# EAGLE schematic shelves_v60 (EAGLE 9.6.2)

## Sheet 1 of 5
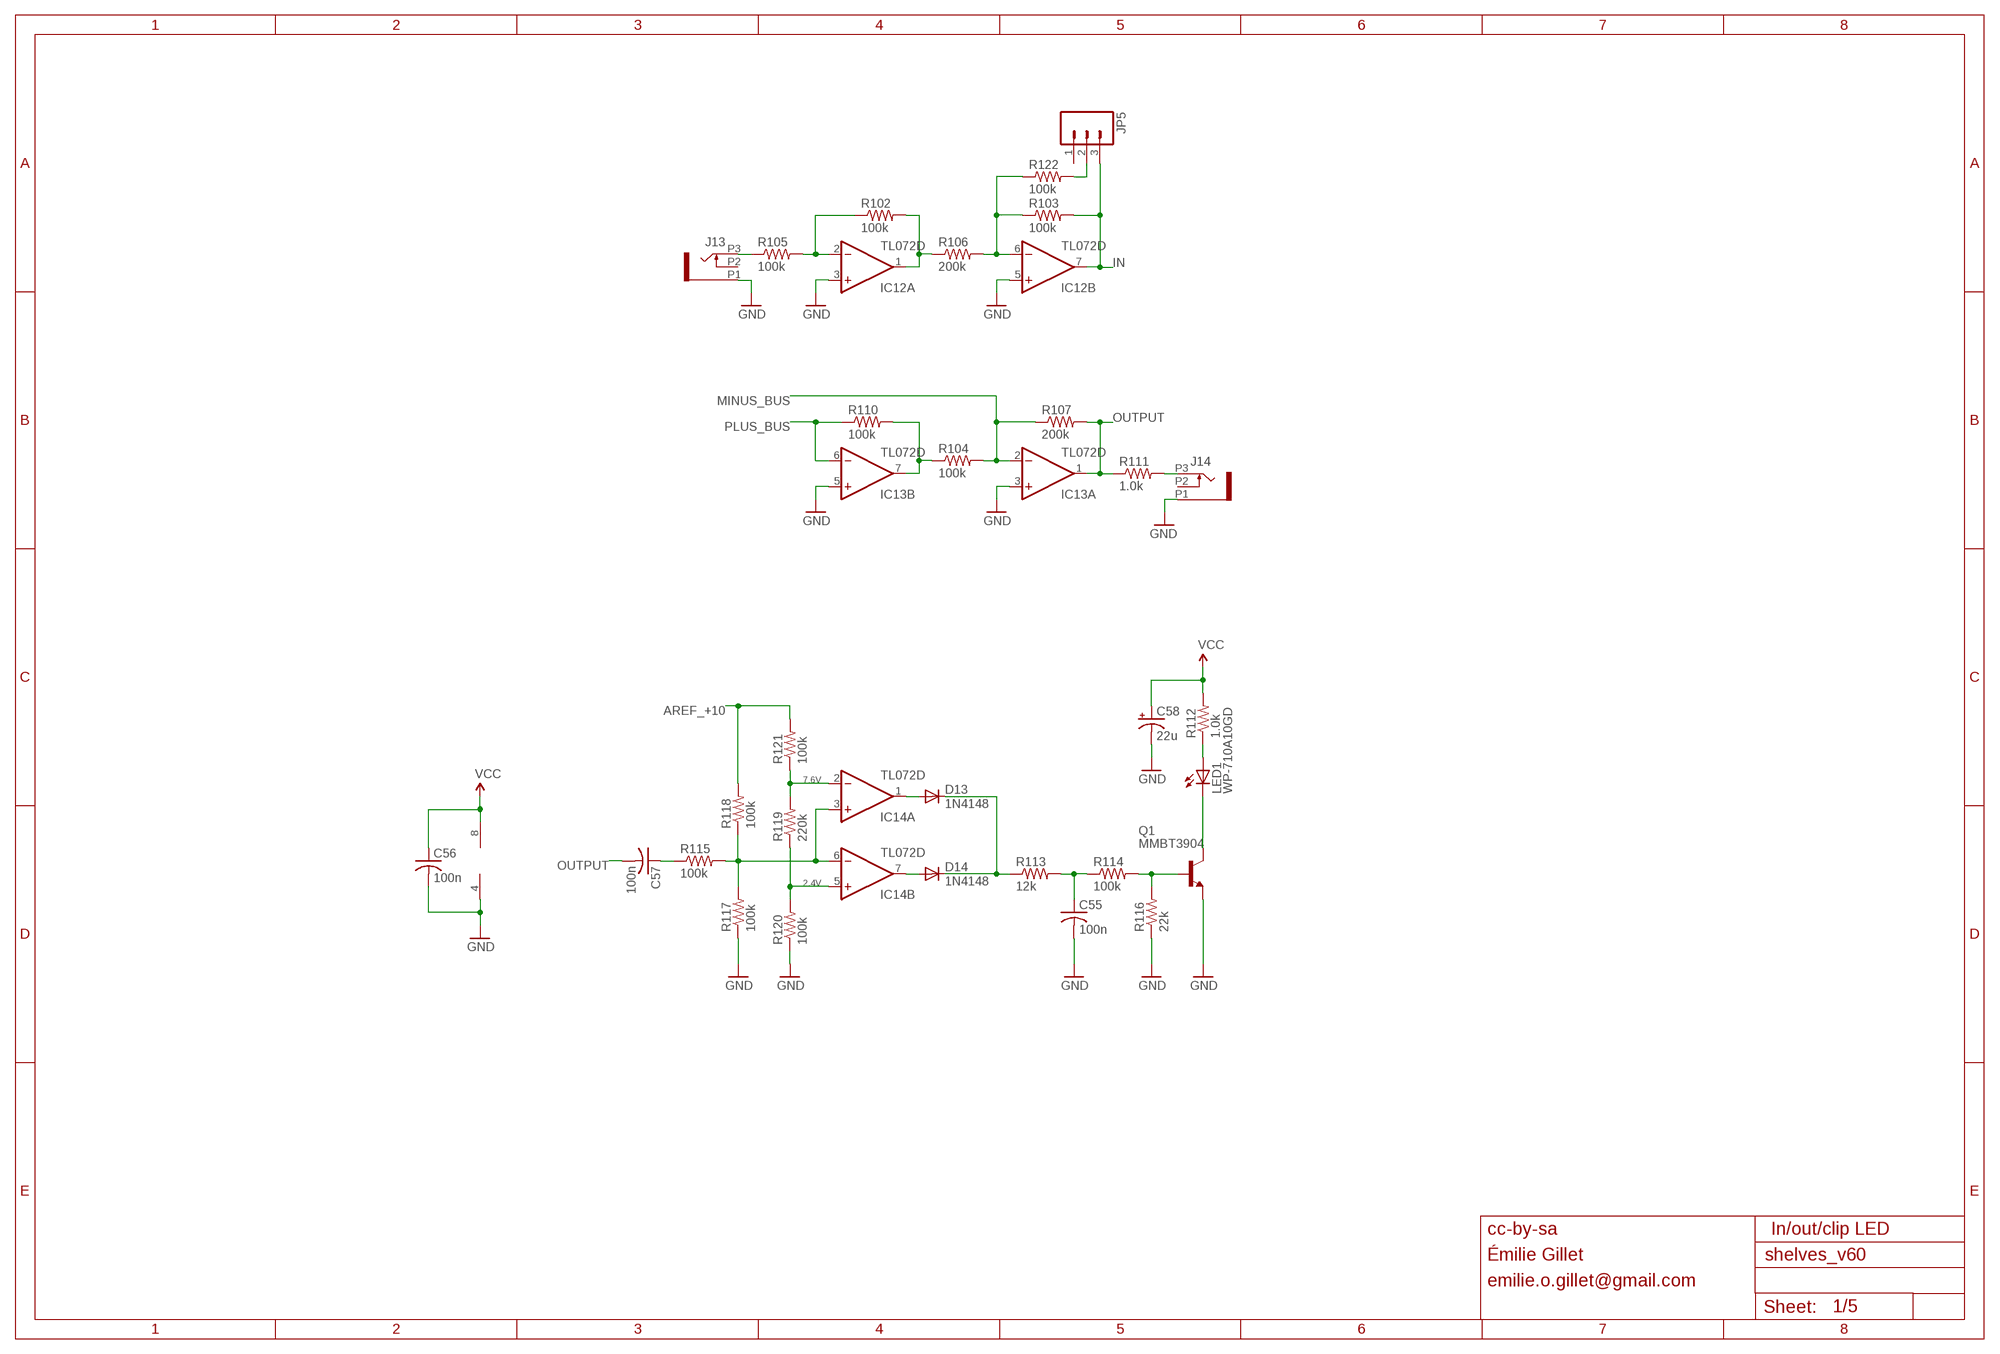
[diagram p0: schematic, sheet 1]

### Parts
C55  100n  C-USC0603  [C0603]
C56  100n  C-USC0603  [C0603]
C57  100n  C-USC0603  [C0603]
C58  22u  CPOL-USC  [PANASONIC_C]
D13  1N4148  DIODE-SOD323-W  [SOD323-W]
D14  1N4148  DIODE-SOD323-W  [SOD323-W]
IC12  TL072D  [SO08]
IC13  TL072D  [SO08]
IC14  TL072D  [SO08]
J13  PJ301_THONKICONN6  [WQP_PJ_301M6]
J14  PJ301_THONKICONN6  [WQP_PJ_301M6]
JP5  M03PTH  [1X03]
LED1  WP-710A10GD  LED3MM  [LED3MM]
Q1  MMBT3904  MMBT3904LT1-NPN-SOT23-BEC  [SOT23-BEC]
R102  100k  R-US_R0603  [R0603]
R103  100k  R-US_R0603  [R0603]
R104  100k  R-US_R0603  [R0603]
R105  100k  R-US_R0603  [R0603]
R106  200k  R-US_R0603  [R0603]
R107  200k  R-US_R0603  [R0603]
R110  100k  R-US_R0603  [R0603]
R111  1.0k  R-US_R0603  [R0603]
R112  1.0k  R-US_R0603  [R0603]
R113  12k  R-US_R0603  [R0603]
R114  100k  R-US_R0603  [R0603]
R115  100k  R-US_R0603  [R0603]
R116  22k  R-US_R0603  [R0603]
R117  100k  R-US_R0603  [R0603]
R118  100k  R-US_R0603  [R0603]
R119  220k  R-US_R0603  [R0603]
R120  100k  R-US_R0603  [R0603]
R121  100k  R-US_R0603  [R0603]
R122  100k  R-US_R0603  [R0603]

### Nets
AREF_+10: R118.2 R121.2 ; also sheet 2,3,4,5
GND: C55.2 C56.2 C58.- IC12.3(A:+IN) IC12.5(B:+IN) IC13.3(A:+IN) IC13.5(B:+IN) IC14.4(P:V-) J13.P1 J14.P1 Q1.E R116.1 R117.1 R120.1 ; also sheet 2,3,4,5
IN: IC12.7(B:OUT) JP5.3 R103.2 ; also sheet 2,3,4
IN_INV: IC12.1(A:OUT) R102.2 R106.1
IN_INV1: IC13.7(B:OUT) R104.1 R110.2
J_IN: J13.P3 R105.1
MINUS_BUS: IC13.2(A:-IN) R104.2 R107.1 ; also sheet 2,3,4
N$6: JP5.2 R122.2
N$9: IC12.2(A:-IN) R102.1 R105.2
N$30: IC12.6(B:-IN) R103.1 R106.2 R122.1
N$60: LED1.K(C) Q1.C
N$93: J14.P3 R111.2
N$94: C57.1 R115.1
N$96: IC14.3(A:+IN) IC14.6(B:-IN) R115.2 R117.2 R118.1
N$97: IC14.2(A:-IN) R119.2 R121.1
N$98: C55.1 R113.2 R114.1
N$99: IC14.5(B:+IN) R119.1 R120.2
N$100: D13.A IC14.1(A:OUT)
N$101: D14.A IC14.7(B:OUT)
N$102: D13.C D14.C R113.1
N$103: LED1.A R112.1
N$104: Q1.B R114.2 R116.2
OUTPUT: C57.2 IC13.1(A:OUT) R107.2 R111.1
PLUS_BUS: IC13.6(B:-IN) R110.1 ; also sheet 2,3,4
VCC: C56.1 C58.+ IC14.8(P:V+) R112.2 ; also sheet 2,3,4,5
Unconnected: J13.P2 J14.P2 JP5.1

### Notes on the sheet
- 7.6V
- 2.4V
- cc-by-sa | In/out/clip LED
- Émilie Gillet
- emilie.o.gillet@gmail.com

## Sheet 2 of 5
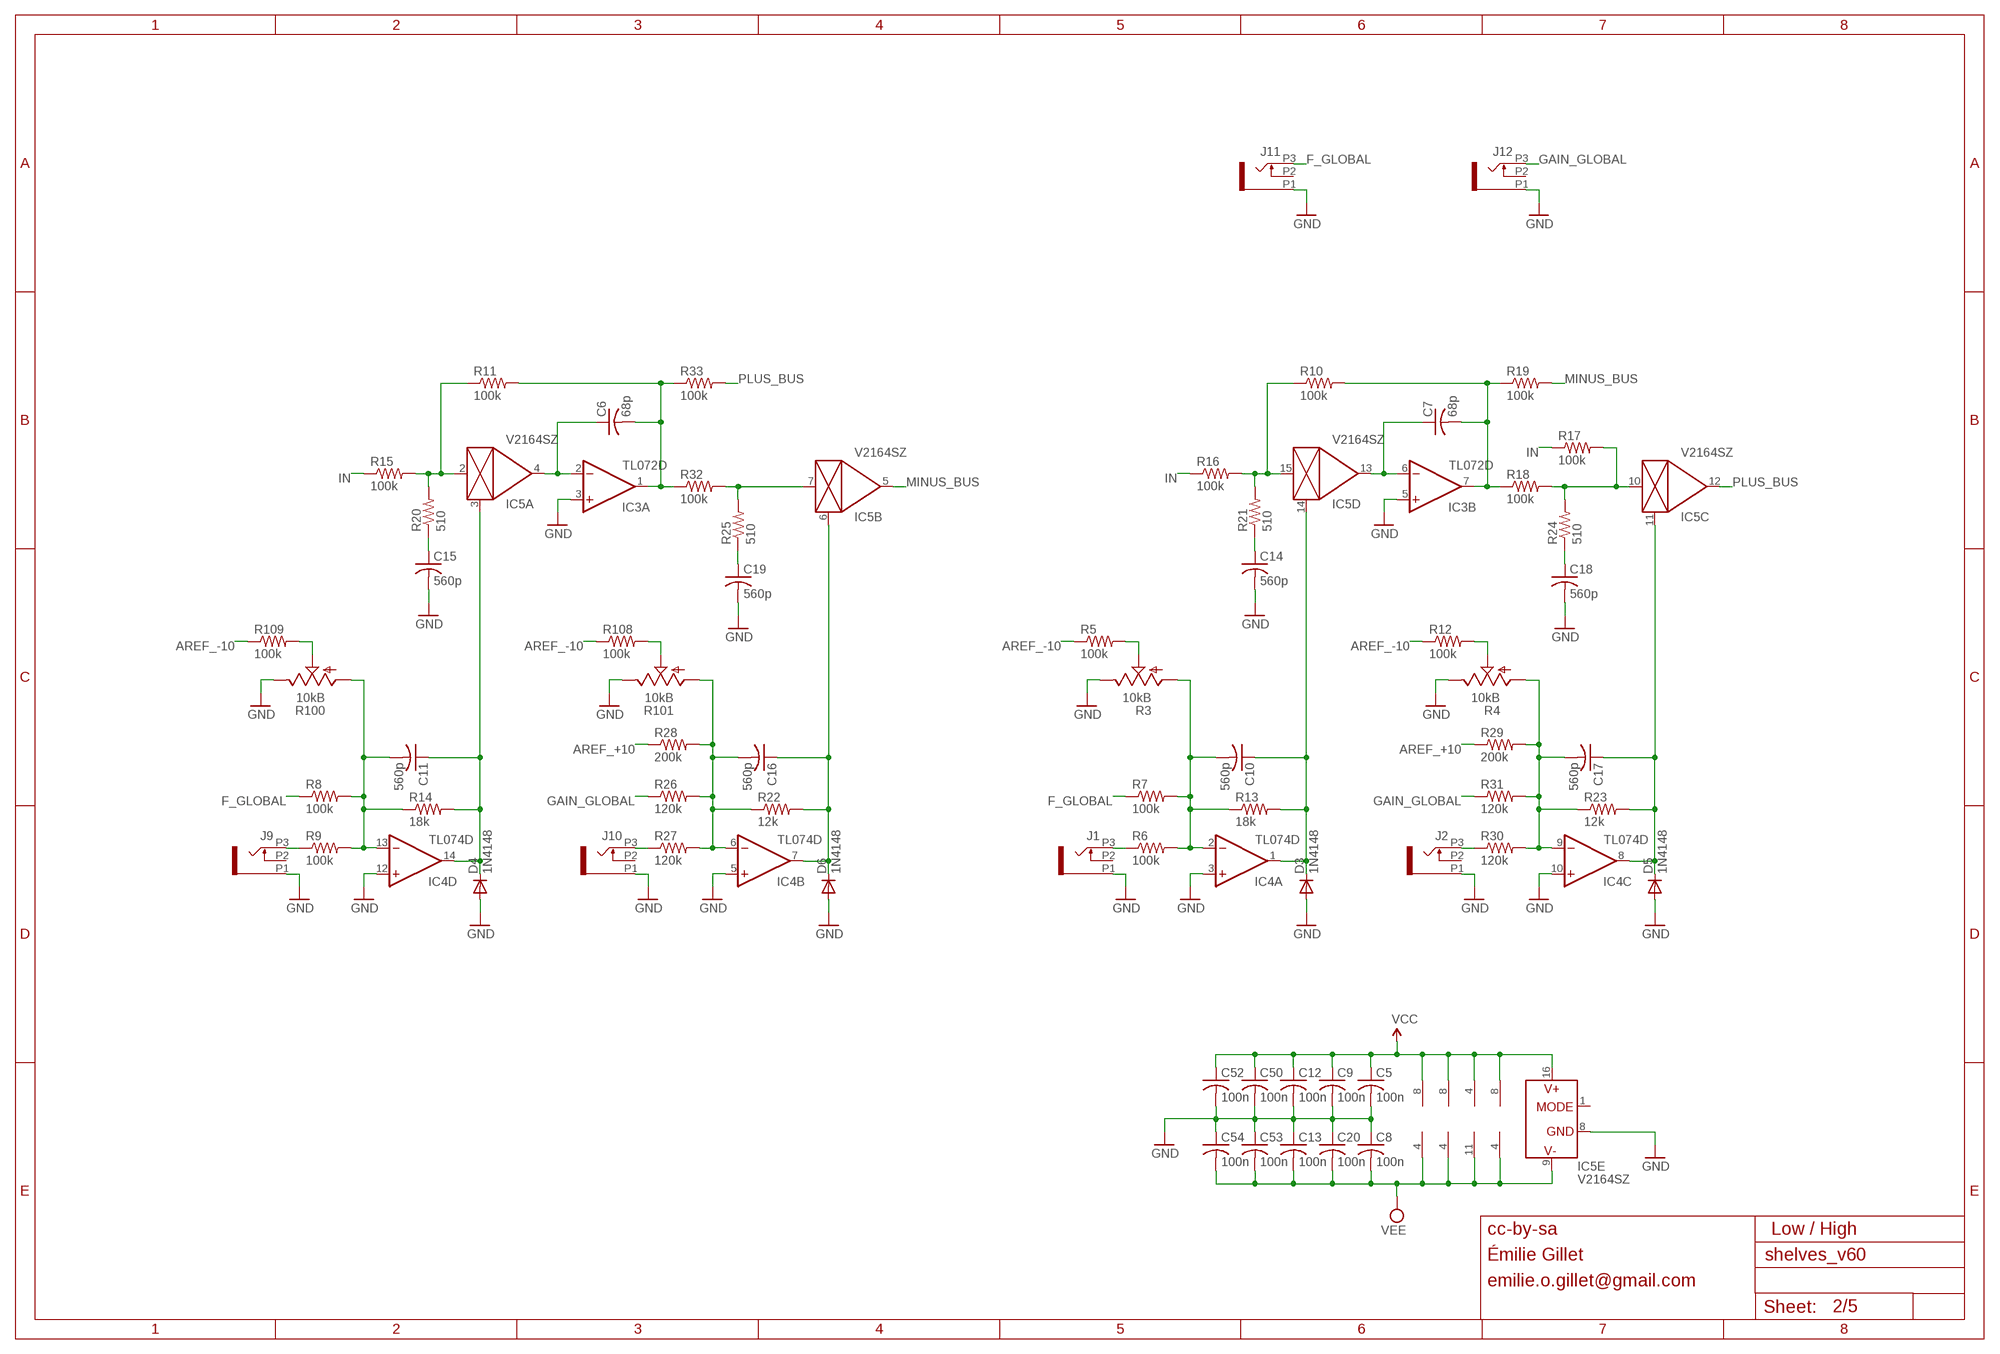
[diagram p1: schematic, sheet 2]

### Parts
C5  100n  C-USC0603  [C0603]
C6  68p  C-USC0603  [C0603]
C7  68p  C-USC0603  [C0603]
C8  100n  C-USC0603  [C0603]
C9  100n  C-USC0603  [C0603]
C10  560p  C-USC0603  [C0603]
C11  560p  C-USC0603  [C0603]
C12  100n  C-USC0603  [C0603]
C13  100n  C-USC0603  [C0603]
C14  560p  C-USC0603  [C0603]
C15  560p  C-USC0603  [C0603]
C16  560p  C-USC0603  [C0603]
C17  560p  C-USC0603  [C0603]
C18  560p  C-USC0603  [C0603]
C19  560p  C-USC0603  [C0603]
C20  100n  C-USC0603  [C0603]
C50  100n  C-USC0603  [C0603]
C52  100n  C-USC0603  [C0603]
C53  100n  C-USC0603  [C0603]
C54  100n  C-USC0603  [C0603]
D3  1N4148  DIODE-SOD323-W  [SOD323-W]
D4  1N4148  DIODE-SOD323-W  [SOD323-W]
D5  1N4148  DIODE-SOD323-W  [SOD323-W]
D6  1N4148  DIODE-SOD323-W  [SOD323-W]
IC3  TL072D  [SO08]
IC4  TL074D  [SO14]
IC5  V2164SZ  SSM2164S  [SOIC16N]
J1  PJ301_THONKICONN6  [WQP_PJ_301M6]
J2  PJ301_THONKICONN6  [WQP_PJ_301M6]
J9  PJ301_THONKICONN6  [WQP_PJ_301M6]
J10  PJ301_THONKICONN6  [WQP_PJ_301M6]
J11  PJ301_THONKICONN6  [WQP_PJ_301M6]
J12  PJ301_THONKICONN6  [WQP_PJ_301M6]
R3  10kB  POT_USVERTICAL_PS  [ALPS_POT_VERTICAL_PS]
R4  10kB  POT_USVERTICAL_PS  [ALPS_POT_VERTICAL_PS]
R5  100k  R-US_R0603  [R0603]
R6  100k  R-US_R0603  [R0603]
R7  100k  R-US_R0603  [R0603]
R8  100k  R-US_R0603  [R0603]
R9  100k  R-US_R0603  [R0603]
R10  100k  R-US_R0603  [R0603]
R11  100k  R-US_R0603  [R0603]
R12  100k  R-US_R0603  [R0603]
R13  18k  R-US_R0603  [R0603]
R14  18k  R-US_R0603  [R0603]
R15  100k  R-US_R0603  [R0603]
R16  100k  R-US_R0603  [R0603]
R17  100k  R-US_R0603  [R0603]
R18  100k  R-US_R0603  [R0603]
R19  100k  R-US_R0603  [R0603]
R20  510  R-US_R0603  [R0603]
R21  510  R-US_R0603  [R0603]
R22  12k  R-US_R0603  [R0603]
R23  12k  R-US_R0603  [R0603]
R24  510  R-US_R0603  [R0603]
R25  510  R-US_R0603  [R0603]
R26  120k  R-US_R0603  [R0603]
R27  120k  R-US_R0603  [R0603]
R28  200k  R-US_R0603  [R0603]
R29  200k  R-US_R0603  [R0603]
R30  120k  R-US_R0603  [R0603]
R31  120k  R-US_R0603  [R0603]
R32  100k  R-US_R0603  [R0603]
R33  100k  R-US_R0603  [R0603]
R100  10kB  POT_USVERTICAL_PS  [ALPS_POT_VERTICAL_PS]
R101  10kB  POT_USVERTICAL_PS  [ALPS_POT_VERTICAL_PS]
R108  100k  R-US_R0603  [R0603]
R109  100k  R-US_R0603  [R0603]

### Nets
AREF_+10: R28.1 R29.1 ; also sheet 1,3,4,5
AREF_-10: R5.1 R12.1 R108.1 R109.1 ; also sheet 3,4,5
F_GLOBAL: J11.P3 R7.1 R8.1 ; also sheet 3,4
GAIN_GLOBAL: J12.P3 R26.1 R31.1 ; also sheet 3,4
GND: C5.2 C8.1 C9.2 C12.2 C13.1 C14.2 C15.2 C18.2 C19.2 C20.1 C50.2 C52.2 C53.1 C54.1 D3.A D4.A D5.A D6.A IC3.3(A:+IN) IC3.5(B:+IN) IC4.3(A:+IN) IC4.5(B:+IN) IC4.10(C:+IN) IC4.12(D:+IN) IC5.8(E:GND) J1.P1 J2.P1 J9.P1 J10.P1 J11.P1 J12.P1 R3.P$1(E) R4.P$1(E) R100.P$1(E) R101.P$1(E) ; also sheet 1,3,4,5
IN: R15.1 R16.1 R17.1 ; also sheet 1,3,4
J_HF_CV: J2.P3 R30.1
J_HF_F: J1.P3 R6.1
J_LF_CV: J10.P3 R27.1
J_LF_F: J9.P3 R9.1
LP: C6.2 IC3.1(A:OUT) R11.2 R32.1 R33.1
LP1: C7.2 IC3.7(B:OUT) R10.2 R18.1 R19.1
MINUS_BUS: IC5.5(B:OUT) R19.2 ; also sheet 1,3,4
N$1: IC5.2(A:IN) R11.1 R15.2 R20.2
N$2: C19.1 R25.1
N$3: C11.1 D4.C IC4.14(D:OUT) IC5.3(A:CTRL) R14.2
N$4: C6.1 IC3.2(A:-IN) IC5.4(A:OUT)
N$5: C14.1 R21.1
N$7: C16.1 D6.C IC4.7(B:OUT) IC5.6(B:CTRL) R22.2
N$10: C15.1 R20.1
N$12: R100.P$2(S) R109.2
N$13: C16.2 IC4.6(B:-IN) R22.1 R26.2 R27.2 R28.2 R101.P$3(A)
N$15: R101.P$2(S) R108.2
N$16: IC5.15(D:IN) R10.1 R16.2 R21.2
N$17: IC5.7(B:IN) R25.2 R32.2
N$18: C11.2 IC4.13(D:-IN) R8.2 R9.2 R14.1 R100.P$3(A)
N$19: C7.1 IC3.6(B:-IN) IC5.13(D:OUT)
N$21: R3.P$2(S) R5.2
N$22: C17.1 D5.C IC4.8(C:OUT) IC5.11(C:CTRL) R23.2
N$23: C17.2 IC4.9(C:-IN) R4.P$3(A) R23.1 R29.2 R30.2 R31.2
N$26: R4.P$2(S) R12.2
N$27: C10.2 IC4.2(A:-IN) R3.P$3(A) R6.2 R7.2 R13.1
N$28: C18.1 R24.1
N$29: IC5.10(C:IN) R17.2 R18.2 R24.2
N$31: C10.1 D3.C IC4.1(A:OUT) IC5.14(D:CTRL) R13.2
PLUS_BUS: IC5.12(C:OUT) R33.2 ; also sheet 1,3,4
VCC: C5.1 C9.1 C12.1 C50.1 C52.1 IC3.8(P:V+) IC4.4(P:V+) IC5.16(E:V+) IC12.8(P:V+) IC13.8(P:V+) ; also sheet 1,3,4,5
VEE: C8.2 C13.2 C20.2 C53.2 C54.2 IC3.4(P:V-) IC4.11(P:V-) IC5.9(E:V-) IC12.4(P:V-) IC13.4(P:V-) ; also sheet 3,4,5
Unconnected: IC5.1(E:MODE) J1.P2 J2.P2 J9.P2 J10.P2 J11.P2 J12.P2

### Notes on the sheet
- cc-by-sa | Low / High
- Émilie Gillet
- emilie.o.gillet@gmail.com

## Sheet 3 of 5
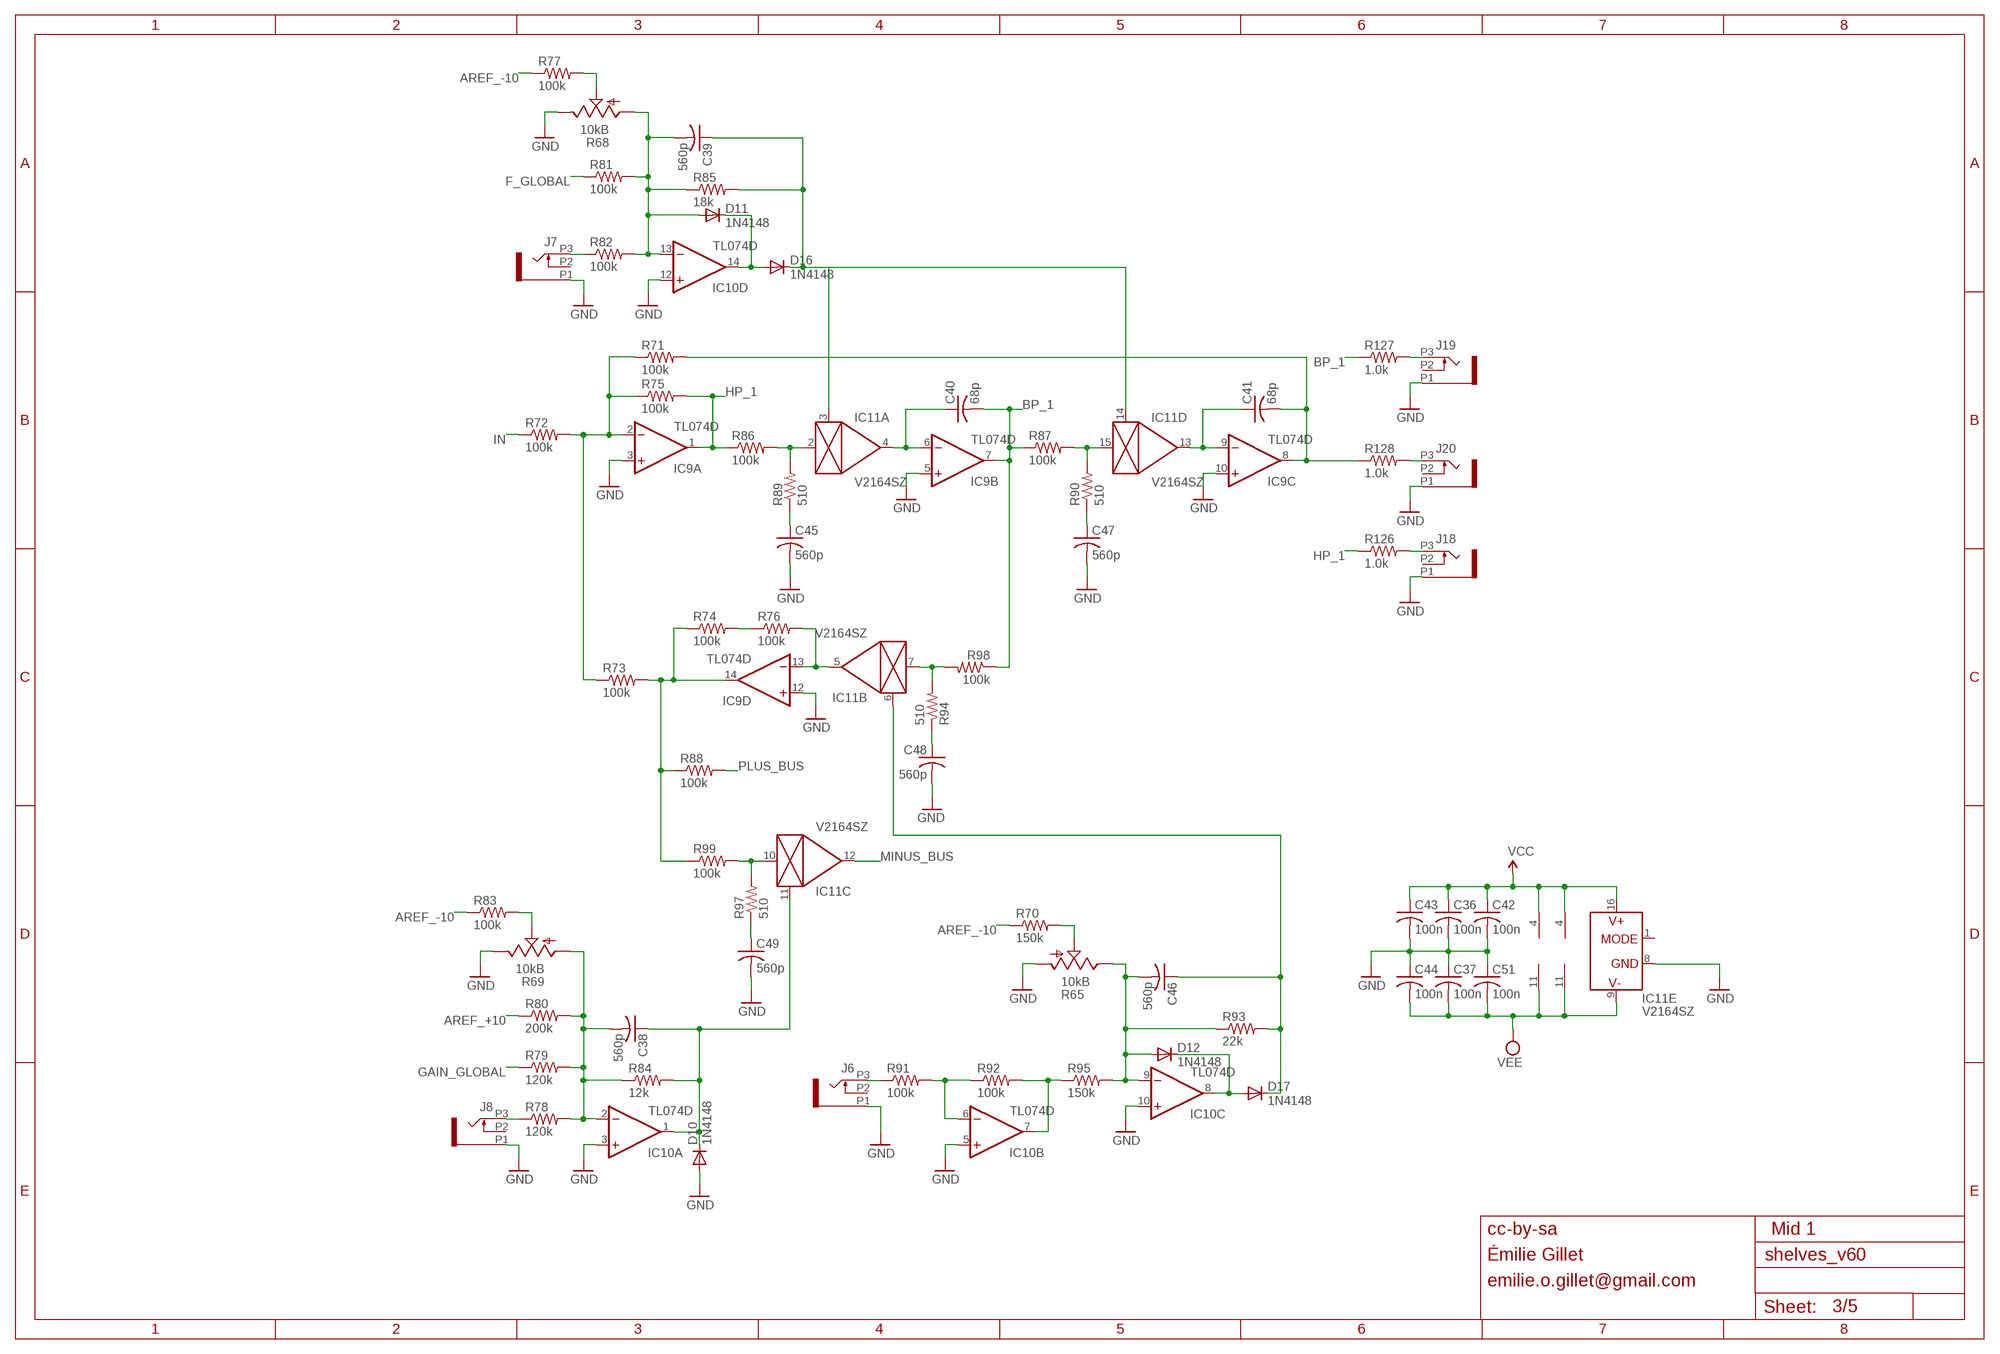
[diagram p2: schematic, sheet 3]

### Parts
C36  100n  C-USC0603  [C0603]
C37  100n  C-USC0603  [C0603]
C38  560p  C-USC0603  [C0603]
C39  560p  C-USC0603  [C0603]
C40  68p  C-USC0603  [C0603]
C41  68p  C-USC0603  [C0603]
C42  100n  C-USC0603  [C0603]
C43  100n  C-USC0603  [C0603]
C44  100n  C-USC0603  [C0603]
C45  560p  C-USC0603  [C0603]
C46  560p  C-USC0603  [C0603]
C47  560p  C-USC0603  [C0603]
C48  560p  C-USC0603  [C0603]
C49  560p  C-USC0603  [C0603]
C51  100n  C-USC0603  [C0603]
D10  1N4148  DIODE-SOD323-W  [SOD323-W]
D11  1N4148  DIODE-SOD323-W  [SOD323-W]
D12  1N4148  DIODE-SOD323-W  [SOD323-W]
D16  1N4148  DIODE-SOD323-W  [SOD323-W]
D17  1N4148  DIODE-SOD323-W  [SOD323-W]
IC9  TL074D  [SO14]
IC10  TL074D  [SO14]
IC11  V2164SZ  SSM2164S  [SOIC16N]
J6  PJ301_THONKICONN6  [WQP_PJ_301M6]
J7  PJ301_THONKICONN6  [WQP_PJ_301M6]
J8  PJ301_THONKICONN6  [WQP_PJ_301M6]
J18  PJ301_THONKICONN6  [WQP_PJ_301M6]
J19  PJ301_THONKICONN6  [WQP_PJ_301M6]
J20  PJ301_THONKICONN6  [WQP_PJ_301M6]
R65  10kB  POT_USVERTICAL  [ALPS_POT_VERTICAL]
R68  10kB  POT_USVERTICAL_PS  [ALPS_POT_VERTICAL_PS]
R69  10kB  POT_USVERTICAL_PS  [ALPS_POT_VERTICAL_PS]
R70  150k  R-US_R0603  [R0603]
R71  100k  R-US_R0603  [R0603]
R72  100k  R-US_R0603  [R0603]
R73  100k  R-US_R0603  [R0603]
R74  100k  R-US_R0603  [R0603]
R75  100k  R-US_R0603  [R0603]
R76  100k  R-US_R0603  [R0603]
R77  100k  R-US_R0603  [R0603]
R78  120k  R-US_R0603  [R0603]
R79  120k  R-US_R0603  [R0603]
R80  200k  R-US_R0603  [R0603]
R81  100k  R-US_R0603  [R0603]
R82  100k  R-US_R0603  [R0603]
R83  100k  R-US_R0603  [R0603]
R84  12k  R-US_R0603  [R0603]
R85  18k  R-US_R0603  [R0603]
R86  100k  R-US_R0603  [R0603]
R87  100k  R-US_R0603  [R0603]
R88  100k  R-US_R0603  [R0603]
R89  510  R-US_R0603  [R0603]
R90  510  R-US_R0603  [R0603]
R91  100k  R-US_R0603  [R0603]
R92  100k  R-US_R0603  [R0603]
R93  22k  R-US_R0603  [R0603]
R94  510  R-US_R0603  [R0603]
R95  150k  R-US_R0603  [R0603]
R97  510  R-US_R0603  [R0603]
R98  100k  R-US_R0603  [R0603]
R99  100k  R-US_R0603  [R0603]
R126  1.0k  R-US_R0603  [R0603]
R127  1.0k  R-US_R0603  [R0603]
R128  1.0k  R-US_R0603  [R0603]

### Nets
AREF_+10: R80.1 ; also sheet 1,2,4,5
AREF_-10: R70.1 R77.1 R83.1 ; also sheet 2,4,5
BP_1: C40.2 IC9.7(B:OUT) R87.1 R98.1 R127.1
F_GLOBAL: R81.1 ; also sheet 2,4
GAIN_GLOBAL: R79.1 ; also sheet 2,4
GND: C36.2 C37.1 C42.2 C43.2 C44.1 C45.2 C47.2 C48.2 C49.2 C51.1 D10.A IC9.3(A:+IN) IC9.5(B:+IN) IC9.10(C:+IN) IC9.12(D:+IN) IC10.3(A:+IN) IC10.5(B:+IN) IC10.10(C:+IN) IC10.12(D:+IN) IC11.8(E:GND) J6.P1 J7.P1 J8.P1 J18.P1 J19.P1 J20.P1 R65.P$3(A) R68.P$1(E) R69.P$1(E) ; also sheet 1,2,4,5
HP_1: IC9.1(A:OUT) R75.2 R86.1 R126.1
IN: R72.1 ; also sheet 1,2,4
MID1_F2: C39.1 D16.C IC11.3(A:CTRL) IC11.14(D:CTRL) R85.2
MINUS_BUS: IC11.12(C:OUT) ; also sheet 1,2,4
N$8: D11.C D16.A IC10.14(D:OUT)
N$11: IC10.7(B:OUT) R92.2 R95.1
N$20: J19.P3 R127.2
N$24: J18.P3 R126.2
N$25: C45.1 R89.1
N$32: J7.P3 R82.1
N$33: R68.P$2(S) R77.2
N$34: C38.1 D10.C IC10.1(A:OUT) IC11.11(C:CTRL) R84.2
N$35: C38.2 IC10.2(A:-IN) R69.P$3(A) R78.2 R79.2 R80.2 R84.1
N$36: J8.P3 R78.1
N$37: R69.P$2(S) R83.2
N$38: C39.2 D11.A IC10.13(D:-IN) R68.P$3(A) R81.2 R82.2 R85.1
N$39: C49.1 R97.1
N$40: IC11.10(C:IN) R97.2 R99.2
N$41: IC9.2(A:-IN) R71.1 R72.2 R73.1 R75.1
N$42: J20.P3 R128.2
N$43: IC11.2(A:IN) R86.2 R89.2
N$44: C40.1 IC9.6(B:-IN) IC11.4(A:OUT)
N$45: C47.1 R90.1
N$48: IC11.15(D:IN) R87.2 R90.2
N$49: C41.1 IC9.9(C:-IN) IC11.13(D:OUT)
N$50: C41.2 IC9.8(C:OUT) R71.2 R128.1
N$51: C48.1 R94.1
N$52: IC11.7(B:IN) R94.2 R98.2
N$53: IC9.13(D:-IN) IC11.5(B:OUT) R76.2
N$54: R74.2 R76.1
N$55: IC9.14(D:OUT) R73.2 R74.1 R88.1 R99.1
N$57: C46.1 D17.C IC11.6(B:CTRL) R93.2
N$58: C46.2 D12.A IC10.9(C:-IN) R65.P$1(E) R93.1 R95.2
N$59: R65.P$2(S) R70.2
N$62: J6.P3 R91.1
N$91: IC10.6(B:-IN) R91.2 R92.1
N$95: D12.C D17.A IC10.8(C:OUT)
PLUS_BUS: R88.2 ; also sheet 1,2,4
VCC: C36.1 C42.1 C43.1 IC9.4(P:V+) IC10.4(P:V+) IC11.16(E:V+) ; also sheet 1,2,4,5
VEE: C37.2 C44.2 C51.2 IC9.11(P:V-) IC10.11(P:V-) IC11.9(E:V-) ; also sheet 2,4,5
Unconnected: IC11.1(E:MODE) J6.P2 J7.P2 J8.P2 J18.P2 J19.P2 J20.P2

### Notes on the sheet
- cc-by-sa | Mid 1
- Émilie Gillet
- emilie.o.gillet@gmail.com

## Sheet 4 of 5
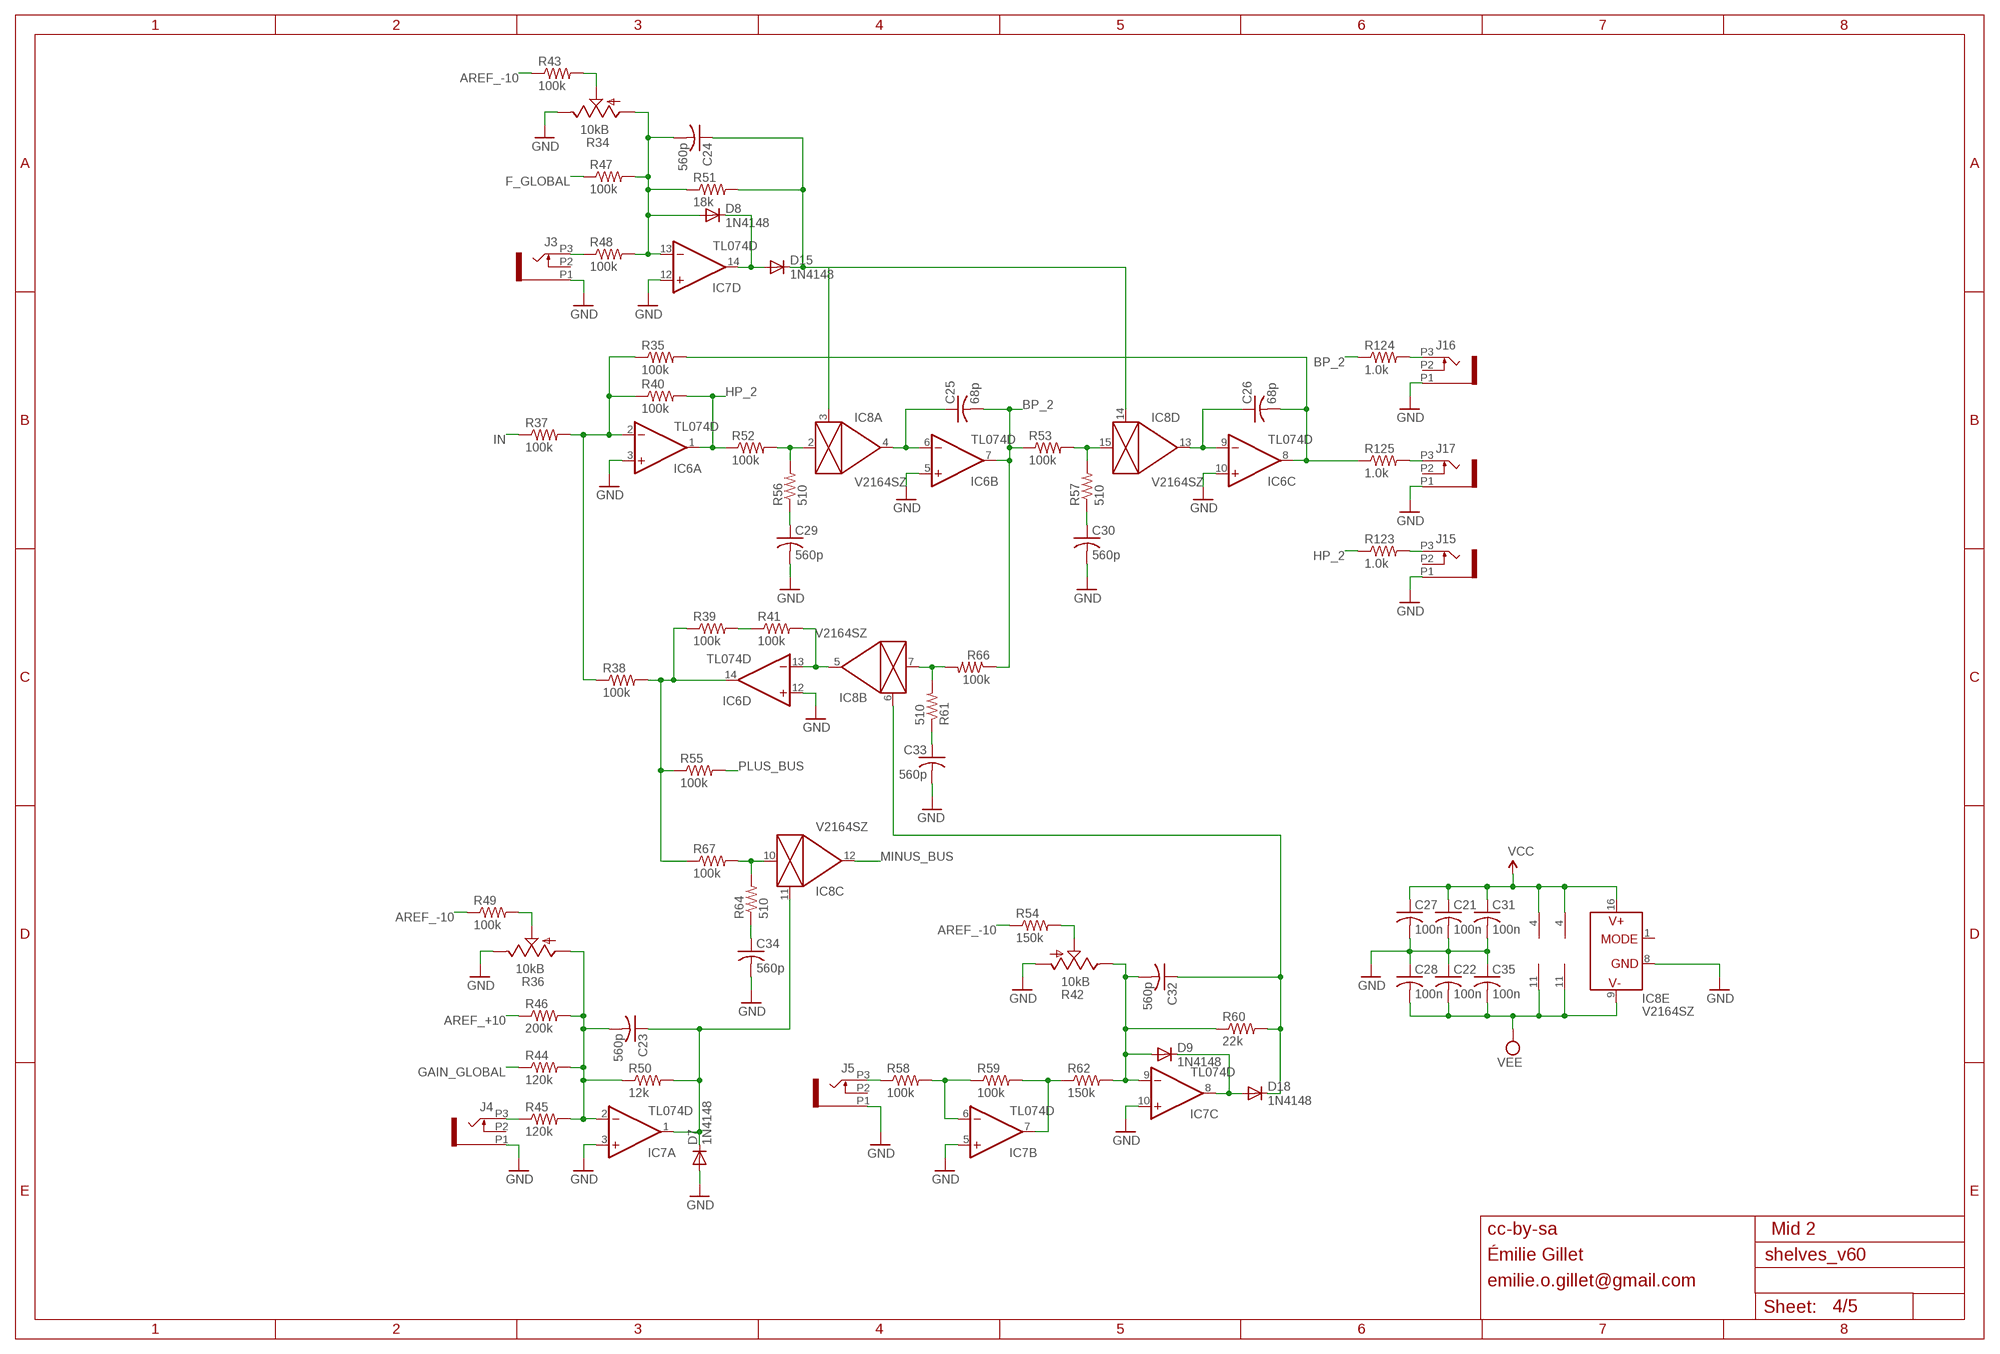
[diagram p3: schematic, sheet 4]

### Parts
C21  100n  C-USC0603  [C0603]
C22  100n  C-USC0603  [C0603]
C23  560p  C-USC0603  [C0603]
C24  560p  C-USC0603  [C0603]
C25  68p  C-USC0603  [C0603]
C26  68p  C-USC0603  [C0603]
C27  100n  C-USC0603  [C0603]
C28  100n  C-USC0603  [C0603]
C29  560p  C-USC0603  [C0603]
C30  560p  C-USC0603  [C0603]
C31  100n  C-USC0603  [C0603]
C32  560p  C-USC0603  [C0603]
C33  560p  C-USC0603  [C0603]
C34  560p  C-USC0603  [C0603]
C35  100n  C-USC0603  [C0603]
D7  1N4148  DIODE-SOD323-W  [SOD323-W]
D8  1N4148  DIODE-SOD323-W  [SOD323-W]
D9  1N4148  DIODE-SOD323-W  [SOD323-W]
D15  1N4148  DIODE-SOD323-W  [SOD323-W]
D18  1N4148  DIODE-SOD323-W  [SOD323-W]
IC6  TL074D  [SO14]
IC7  TL074D  [SO14]
IC8  V2164SZ  SSM2164S  [SOIC16N]
J3  PJ301_THONKICONN6  [WQP_PJ_301M6]
J4  PJ301_THONKICONN6  [WQP_PJ_301M6]
J5  PJ301_THONKICONN6  [WQP_PJ_301M6]
J15  PJ301_THONKICONN6  [WQP_PJ_301M6]
J16  PJ301_THONKICONN6  [WQP_PJ_301M6]
J17  PJ301_THONKICONN6  [WQP_PJ_301M6]
R34  10kB  POT_USVERTICAL_PS  [ALPS_POT_VERTICAL_PS]
R35  100k  R-US_R0603  [R0603]
R36  10kB  POT_USVERTICAL_PS  [ALPS_POT_VERTICAL_PS]
R37  100k  R-US_R0603  [R0603]
R38  100k  R-US_R0603  [R0603]
R39  100k  R-US_R0603  [R0603]
R40  100k  R-US_R0603  [R0603]
R41  100k  R-US_R0603  [R0603]
R42  10kB  POT_USVERTICAL  [ALPS_POT_VERTICAL]
R43  100k  R-US_R0603  [R0603]
R44  120k  R-US_R0603  [R0603]
R45  120k  R-US_R0603  [R0603]
R46  200k  R-US_R0603  [R0603]
R47  100k  R-US_R0603  [R0603]
R48  100k  R-US_R0603  [R0603]
R49  100k  R-US_R0603  [R0603]
R50  12k  R-US_R0603  [R0603]
R51  18k  R-US_R0603  [R0603]
R52  100k  R-US_R0603  [R0603]
R53  100k  R-US_R0603  [R0603]
R54  150k  R-US_R0603  [R0603]
R55  100k  R-US_R0603  [R0603]
R56  510  R-US_R0603  [R0603]
R57  510  R-US_R0603  [R0603]
R58  100k  R-US_R0603  [R0603]
R59  100k  R-US_R0603  [R0603]
R60  22k  R-US_R0603  [R0603]
R61  510  R-US_R0603  [R0603]
R62  150k  R-US_R0603  [R0603]
R64  510  R-US_R0603  [R0603]
R66  100k  R-US_R0603  [R0603]
R67  100k  R-US_R0603  [R0603]
R123  1.0k  R-US_R0603  [R0603]
R124  1.0k  R-US_R0603  [R0603]
R125  1.0k  R-US_R0603  [R0603]

### Nets
AREF_+10: R46.1 ; also sheet 1,2,3,5
AREF_-10: R43.1 R49.1 R54.1 ; also sheet 2,3,5
BP_2: C25.2 IC6.7(B:OUT) R53.1 R66.1 R124.1
F_GLOBAL: R47.1 ; also sheet 2,3
GAIN_GLOBAL: R44.1 ; also sheet 2,3
GND: C21.2 C22.1 C27.2 C28.1 C29.2 C30.2 C31.2 C33.2 C34.2 C35.1 D7.A IC6.3(A:+IN) IC6.5(B:+IN) IC6.10(C:+IN) IC6.12(D:+IN) IC7.3(A:+IN) IC7.5(B:+IN) IC7.10(C:+IN) IC7.12(D:+IN) IC8.8(E:GND) J3.P1 J4.P1 J5.P1 J15.P1 J16.P1 J17.P1 R34.P$1(E) R36.P$1(E) R42.P$3(A) ; also sheet 1,2,3,5
HP_2: IC6.1(A:OUT) R40.2 R52.1 R123.1
IN: R37.1 ; also sheet 1,2,3
MID1_F1: C24.1 D15.C IC8.3(A:CTRL) IC8.14(D:CTRL) R51.2
MINUS_BUS: IC8.12(C:OUT) ; also sheet 1,2,3
N$14: D8.C D15.A IC7.14(D:OUT)
N$46: J16.P3 R124.2
N$47: C29.1 R56.1
N$61: IC7.7(B:OUT) R59.2 R62.1
N$63: J3.P3 R48.1
N$65: R34.P$2(S) R43.2
N$66: C23.1 D7.C IC7.1(A:OUT) IC8.11(C:CTRL) R50.2
N$67: C23.2 IC7.2(A:-IN) R36.P$3(A) R44.2 R45.2 R46.2 R50.1
N$68: J4.P3 R45.1
N$69: R36.P$2(S) R49.2
N$70: C24.2 D8.A IC7.13(D:-IN) R34.P$3(A) R47.2 R48.2 R51.1
N$71: C34.1 R64.1
N$72: IC8.10(C:IN) R64.2 R67.2
N$73: IC6.2(A:-IN) R35.1 R37.2 R38.1 R40.1
N$74: J15.P3 R123.2
N$75: IC8.2(A:IN) R52.2 R56.2
N$76: C25.1 IC6.6(B:-IN) IC8.4(A:OUT)
N$77: C30.1 R57.1
N$78: J17.P3 R125.2
N$79: IC8.15(D:IN) R53.2 R57.2
N$80: C26.1 IC6.9(C:-IN) IC8.13(D:OUT)
N$81: C26.2 IC6.8(C:OUT) R35.2 R125.1
N$82: C33.1 R61.1
N$83: IC8.7(B:IN) R61.2 R66.2
N$84: IC6.13(D:-IN) IC8.5(B:OUT) R41.2
N$85: R39.2 R41.1
N$86: IC6.14(D:OUT) R38.2 R39.1 R55.1 R67.1
N$87: C32.1 D18.C IC8.6(B:CTRL) R60.2
N$88: C32.2 D9.A IC7.9(C:-IN) R42.P$1(E) R60.1 R62.2
N$89: IC7.6(B:-IN) R58.2 R59.1
N$90: R42.P$2(S) R54.2
N$92: J5.P3 R58.1
N$105: D9.C D18.A IC7.8(C:OUT)
PLUS_BUS: R55.2 ; also sheet 1,2,3
VCC: C21.1 C27.1 C31.1 IC6.4(P:V+) IC7.4(P:V+) IC8.16(E:V+) ; also sheet 1,2,3,5
VEE: C22.2 C28.2 C35.2 IC6.11(P:V-) IC7.11(P:V-) IC8.9(E:V-) ; also sheet 2,3,5
Unconnected: IC8.1(E:MODE) J3.P2 J4.P2 J5.P2 J15.P2 J16.P2 J17.P2

### Notes on the sheet
- cc-by-sa | Mid 2
- Émilie Gillet
- emilie.o.gillet@gmail.com

## Sheet 5 of 5
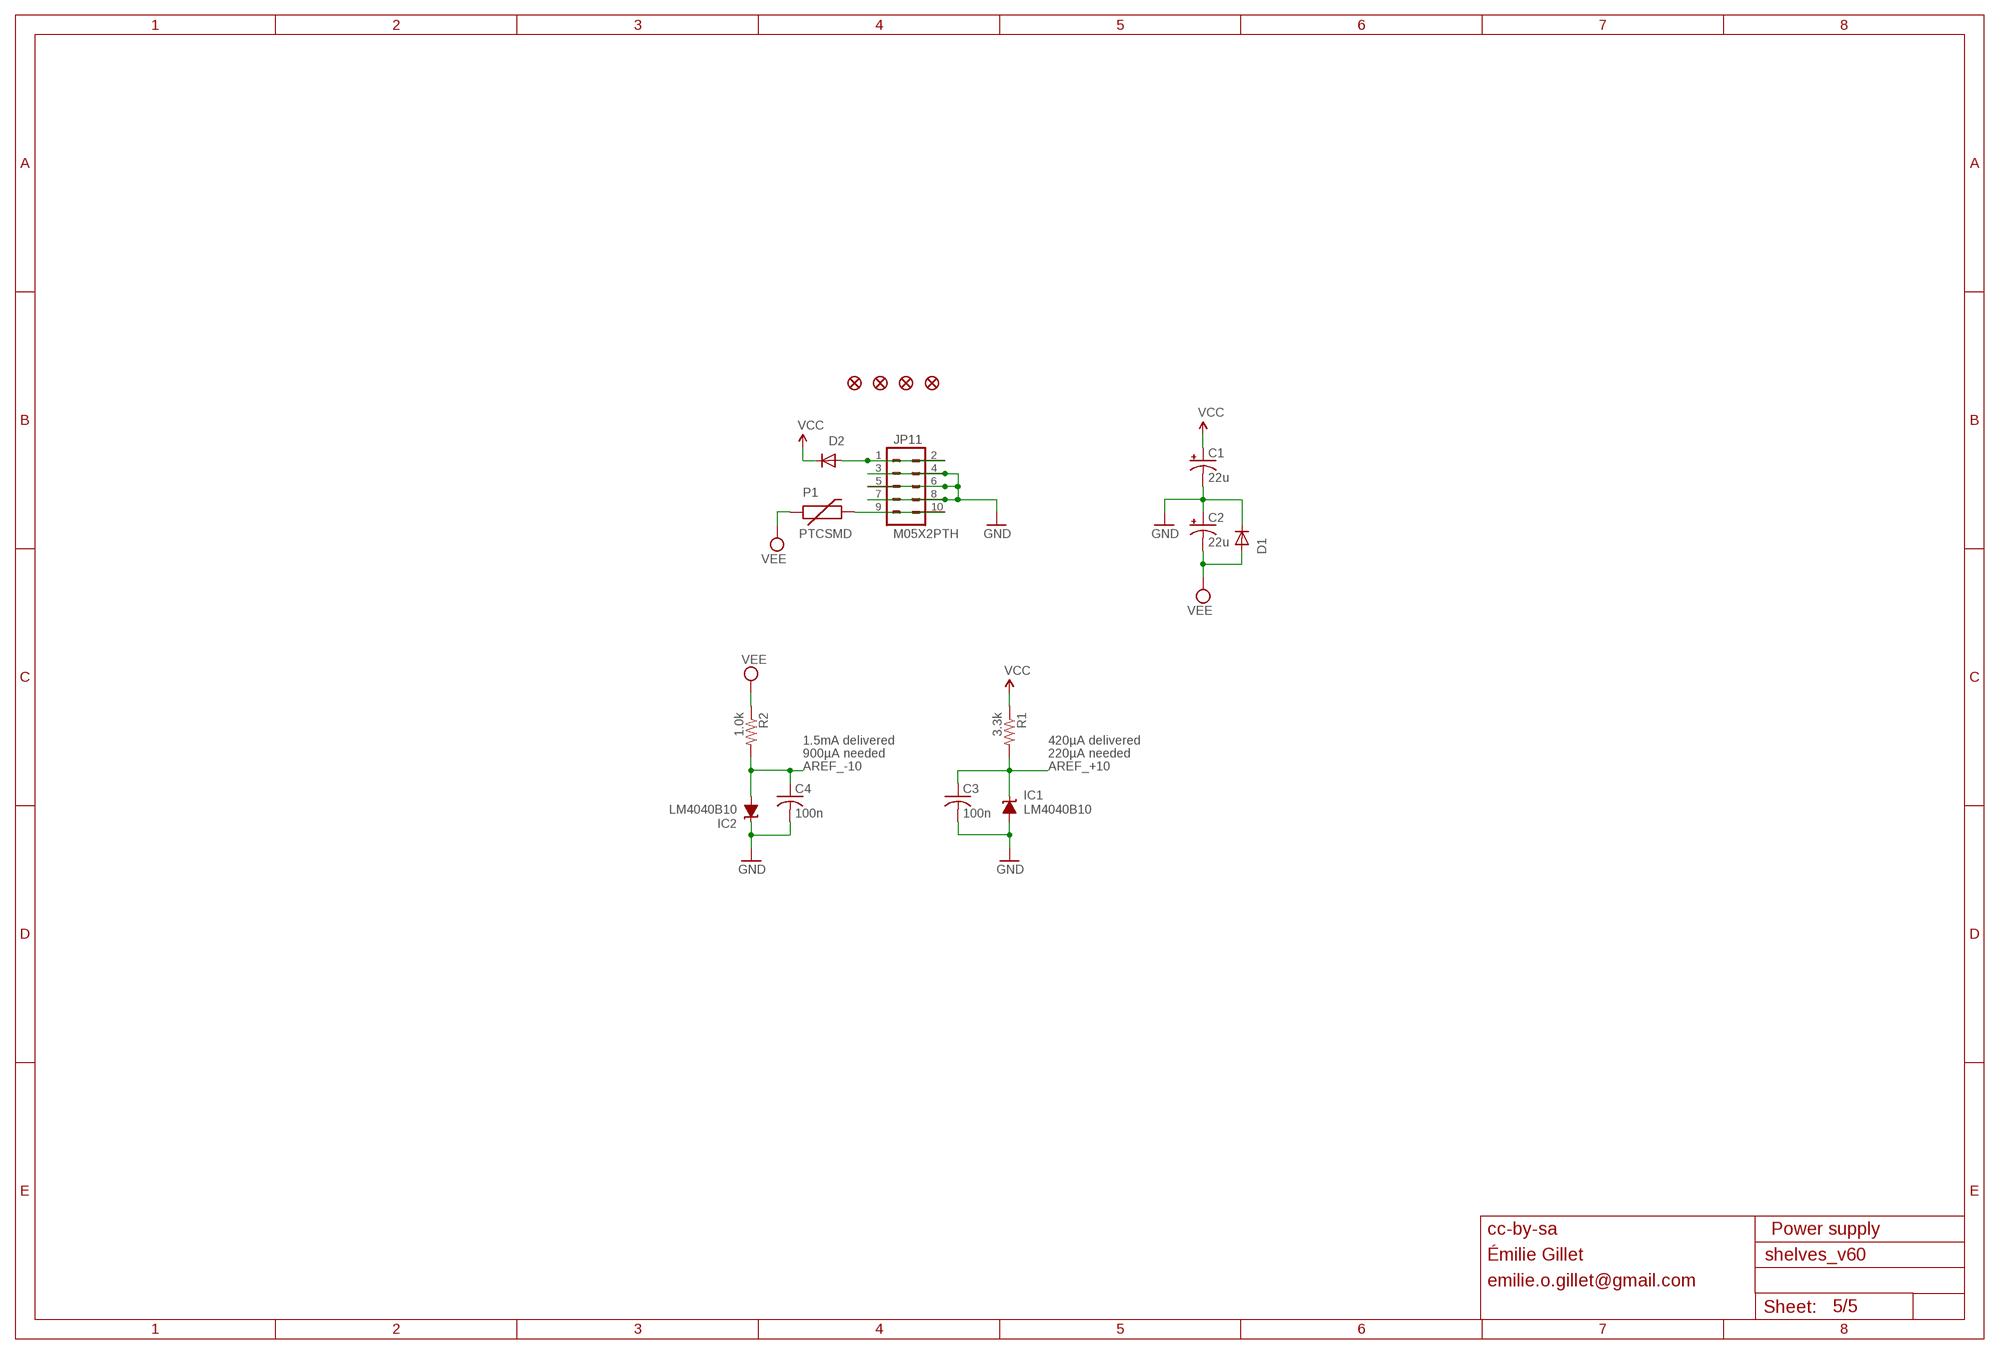
[diagram p4: schematic, sheet 5]

### Parts
C1  22u  CPOL-USC  [PANASONIC_C]
C2  22u  CPOL-USC  [PANASONIC_C]
C3  100n  C-USC0603  [C0603]
C4  100n  C-USC0603  [C0603]
D1  1N5819HW  DIODE-SOD123  [SOD123]
D2  1N5819HW  DIODE-SOD123  [SOD123]
IC1  LM4040B10  LM4041B12DBZ  [DBZ_R-PDSO-G3]
IC2  LM4040B10  LM4041B12DBZ  [DBZ_R-PDSO-G3]
JP1  FIDUCIAL1X2  [FIDUCIAL-1X2]
JP2  FIDUCIAL1X2  [FIDUCIAL-1X2]
JP3  FIDUCIAL1X2  [FIDUCIAL-1X2]
JP4  FIDUCIAL1X2  [FIDUCIAL-1X2]
JP11  M05X2PTH  [AVR_ICSP]
P1  PTCSMD  [PTC-1206]
R1  3.3k  R-US_R0603  [R0603]
R2  1.0k  R-US_R0603  [R0603]

### Nets
AREF_+10: C3.1 IC1.1(C) R1.2 ; also sheet 1,2,3,4
AREF_-10: C4.1 IC2.2(A) R2.2 ; also sheet 2,3,4
GND: C1.- C2.+ C3.2 C4.2 D1.C IC1.2(A) IC2.1(C) JP11.3 JP11.4 JP11.5 JP11.6 JP11.7 JP11.8 ; also sheet 1,2,3,4
N$56: D2.A JP11.1 JP11.2
N$64: JP11.9 JP11.10 P1.2
VCC: C1.+ D2.C R1.1 ; also sheet 1,2,3,4
VEE: C2.- D1.A P1.1 R2.1 ; also sheet 2,3,4

### Notes on the sheet
- 1.5mA delivered | 420µA delivered
- 900µA needed | 220µA needed
- cc-by-sa | Power supply
- Émilie Gillet
- emilie.o.gillet@gmail.com

## Library data of the parts
C1 C2 C58 = rcl:CPOL-US: POLARIZED CAPACITOR, American symbol
C3-C57 = rcl:C-US: CAPACITOR, American symbol
D1-D18 = diode:DIODE-: DIODE
IC1 IC2 = texas:LM4041: PRECISION MICROPOWER SHUNT VOLTAGE REFERENCE Source: http://focus.ti.com/lit/ds/slcs146e/slcs146e.pdf
IC3 IC12-IC14 = og-linear:TL072: OP AMP
IC4 IC6 IC7 IC9 IC10 = linear:TL074: OP AMP
IC5 IC8 IC11 = ssm2164:SSM2164
J1-J20 = og-pj301:PJ301_THONKICONN
JP1-JP4 = SparkFun:FIDUCIAL: Fiducial Alignment Points Various fiducial points for machine vision alignment.
JP5 = SparkFun:M03: Header 3 Standard 3-pin 0.1" header. Use with straight break away headers (SKU : PRT-00116), right angle break away headers (PRT-00553), swiss pins (PRT-00743), machine pins (PRT-00117), and female headers (PRT-00115). Molex polarized connector foot print use with SKU : PRT-08232 with associated crimp pins and housings.
JP11 = og-header:M05X2: Header 5x2 Standard 10-pin dual row 0.1" header. Commonly used with AVR-ISP. Use with Spark Fun Electronics SKU: PRT-00778
LED1 = led:LED: LED OSRAM: - CHIPLED LG R971, LG N971, LY N971, LG Q971, LY Q971, LO R971, LY R971 LH N974, LH R974 LS Q976, LO Q976, LY Q976 LO Q996 - Hyper CHIPLED LW Q18S LB Q993, LB Q99A, LB R99A - SideLED LS A670, LO A670, LY A670, LG A670, LP A670 LB A673, LV A673, LT A673, LW A673 LH A674 LY A675 LS A676, LA A676, LO A676, LY A676, LW A676 LS A679, LY A679, LG A679 - Hyper Micro SIDELED® LS Y876, LA Y876, LO Y876, LY Y876 LT Y87S - SmartLED LW L88C, LW L88S LB L89C, LB L89S, LG L890 LS L89K, LO L89K, LY L89K LS L896, LA L896, LO L896, LY L896 - TOPLED LS T670, LO T670, LY T670, LG T670, LP T670 LSG T670, LSP T670, LSY T670, LOP T670, LYG T670 LG T671, LOG T671, LSG T671 LB T673, LV T673, LT T673, LW T673 LH T674 LS T676, LA T676, LO T676, LY T676, LB T676, LH T676, LSB T676, LW T676 LB T67C, LV T67C, LT T67C, LS T67K, LO T67K, LY T67K, LW E67C LS E67B, LA E67B, LO E67B, LY E67B, LB E67C, LV E67C, LT E67C LW T67C LS T679, LY T679, LG T679 LS T770, LO T770, LY T770, LG T770, LP T770 LB T773, LV T773, LT T773, LW T773 LH T774 LS E675, LA E675, LY E675, LS T675 LS T776, LA T776, LO T776, LY T776, LB T776 LHGB T686 LT T68C, LB T68C - Hyper Mini TOPLED® LB M676 - Mini TOPLED Santana® LG M470 LS M47K, LO M47K, LY M47K Source: http://www.osram.convergy.de LUXEON: - LUMILED® LXK2-PW12-R00, LXK2-PW12-S00, LXK2-PW14-U00, LXK2-PW14-V00 LXK2-PM12-R00, LXK2-PM12-S00, LXK2-PM14-U00 LXK2-PE12-Q00, LXK2-PE12-R00, LXK2-PE12-S00, LXK2-PE14-T00, LXK2-PE14-U00 LXK2-PB12-K00, LXK2-PB12-L00, LXK2-PB12-M00, LXK2-PB14-N00, LXK2-PB14-P00, LXK2-PB14-Q00 LXK2-PR12-L00, LXK2-PR12-M00, LXK2-PR14-Q00, LXK2-PR14-R00 LXK2-PD12-Q00, LXK2-PD12-R00, LXK2-PD12-S00 LXK2-PH12-R00, LXK2-PH12-S00 LXK2-PL12-P00, LXK2-PL12-Q00, LXK2-PL12-R00 Source: www.luxeon.com KINGBRIGHT: KA-3528ASYC Source: www.kingbright.com
P1 = SparkFun:PTC: Resettable Fuse PTC Resettable Fuse. Spark Fun Electronics SKU : COM-08357
Q1 = transistor:*-NPN-: NPN Transistror BF959 corrected 2008.03.06
R1 R2 R5-R33 R35 R37-R41 R43-R62 R64 R66 R67 R70-R95 R97-R99 R102-R128 = rcl:R-US_: RESISTOR, American symbol
R3 R4 R34 R36 R42 R65 R68 R69 R100 R101 = pot-alps:POT_US